# EAGLE board BatteryChargerCombiner (EAGLE 8.5.0)
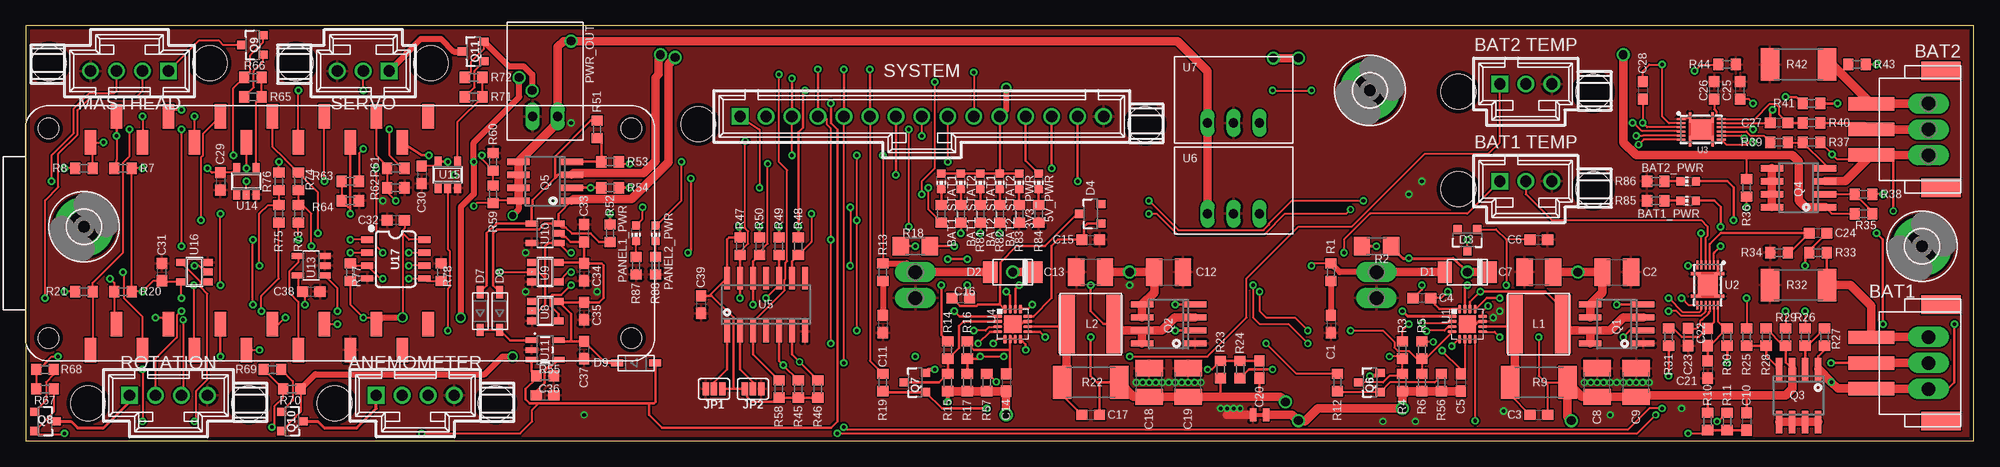
[diagram p2: board, top side]
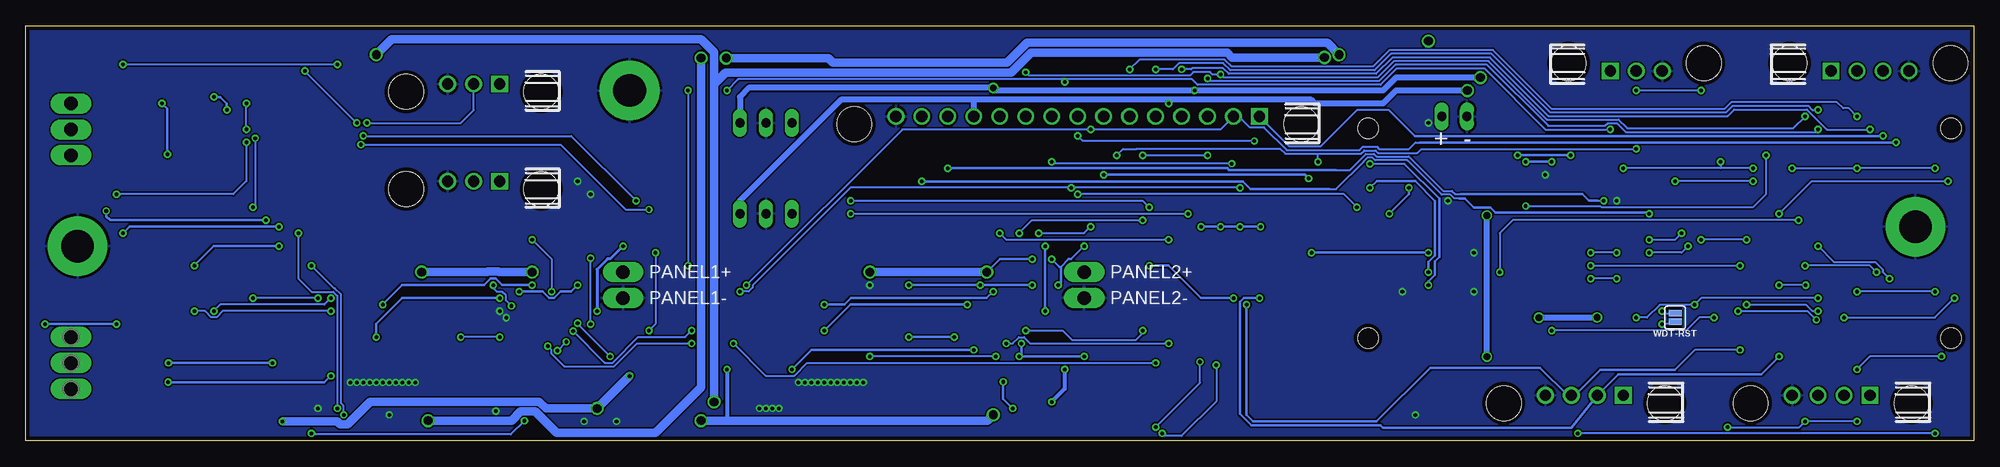
[diagram p3: board, bottom side, seen from below]

Size 190.5 x 40.64 mm. Coordinates in mm from the lower left corner, seen from the top.
Outline: 0,0 190.5,0 190.5,40.64 0,40.64 0,0
Copper layers (1*16): Top 0.0356mm / dielectric 1.5011mm / Bottom 0.0356mm
Design rules "LaenPCBOrder *": minimum track width 6mil, minimum drill 13mil, track to track 6mil, track to pad 6mil, pad to pad 6mil, via to via 6mil, smd to smd 6mil, copper to edge 15mil, drill to drill 6mil, minimum pad ring 7mil, minimum via ring 7mil, stop-mask expansion 4mil, vias tented up to drill 30mil, thermal gap 10mil

## Footprints (pad centres in the part's own frame; a part is rotated, then mirrored left to right if it is on the bottom)
CHIP-LED0603 = smd 0.8 x 0.8: A 0,-0.75; C 0,0.75
70545-POS4 = drill 1.1 square: P$1 3.81,0 | drill 1.1: P$2 1.27,0; P$3 -1.27,0; P$4 -3.81,0 | hole 3.404: -7.874,0.762; 7.874,0.762
JST-XH3-SMD = smd 1.3 x 4.5: BAL 0,-8.75; BAT 2.5,-8.75; RET -2.5,-8.75 | smd 1.8 x 3.9: GND1 -5.7,-1.95; GND2 5.7,-1.95
P1-13Y = drill 1.321 pad 1.905 long: TP 0,0
70545-POS3 = drill 1.1 square: P$1 2.54,0 | drill 1.1: P$2 0,0; P$3 -2.54,0 | hole 3.404: -6.604,0.762; 6.604,0.762
C0603 = smd 1.1 x 1: 1 -0.85,0; 2 0.85,0
C1210 = smd 1.6 x 2.7: 1 -1.4,0; 2 1.4,0
SOD-128 = smd 1.4 x 2.1: A -2.2,0; C 2.2,0
SOT23-3 = smd 0.8 x 0.9: 1 -0.95,-1; 2 0.95,-1; 3 0,1.1
SOD-123 = smd 1.2 x 0.7: A 1.85,0; C -1.85,0
3,2-PAD = drill 3.2 pad 5.842: B3,2 0,0
SMT-JUMPER_3_NO_SILK = smd 0.635 x 1.27: 1 -0.813,0; 2 0,0; 3 0.813,0
DG6050 = smd 1.6 x 5.7: 1 -2.35,0; 2 2.35,0
JST-XH2-THRUHOLE = drill 0.9 long: N -1.23,0; P 1.23,0
SO-08 = smd 0.6 x 2.2: 1 -1.905,-2.6; 2 -0.635,-2.6; 3 0.635,-2.6; 4 1.905,-2.6; 5 1.905,2.6; 6 0.635,2.6; 7 -0.635,2.6; 8 -1.905,2.6
SO08 = smd 0.6 x 2.2: 1 -1.905,-2.6; 2 -0.635,-2.6; 3 0.635,-2.6; 4 1.905,-2.6; 5 1.905,2.6; 6 0.635,2.6; 7 -0.635,2.6; 8 -1.905,2.6
R0603 = smd 1 x 1.1: 1 -0.85,0; 2 0.85,0
R1206 = smd 1.6 x 1.803: 1 -1.422,0; 2 1.422,0
R2512 = smd 1.8 x 3.2: 1 -2.8,0; 2 2.8,0
2PT_GND_TIE = smd 1.27 x 0.635: P$1 0,0.635; P$2 0,-0.635
70545-POS15 = drill 1.1 square: P$1 17.78,0 | drill 1.1: P$2 15.24,0; P$3 12.7,0; P$4 10.16,0; P$5 7.62,0; P$6 5.08,0; P$7 2.54,0; P$8 0,0; P$9 -2.54,0; P$10 -5.08,0; P$11 -7.62,0; P$12 -10.16,0; P$13 -12.7,0; P$14 -15.24,0; P$15 -17.78,0 | hole 3.404: -21.844,0.762; 21.844,0.762
QFN16 = smd 0.85 x 0.3: 1 -1.475,0.75; 2 -1.475,0.25; 3 -1.475,-0.25; 4 -1.475,-0.75; 9 1.475,-0.75; 10 1.475,-0.25; 11 1.475,0.25; 12 1.475,0.75 | smd 0.3 x 0.85: 5 -0.75,-1.475; 6 -0.25,-1.475; 7 0.25,-1.475; 8 0.75,-1.475; 13 0.75,1.475; 14 0.25,1.475; 15 -0.25,1.475; 16 -0.75,1.475 | smd 1.7 x 1.7: TH 0,0
PDSO-N12 = smd 0.2 x 0.85: 1 -1,-1.975; 2 -0.6,-1.975; 3 -0.2,-1.975; 4 0.2,-1.975; 5 0.6,-1.975; 6 1,-1.975; 7 1,1.975; 8 0.6,1.975; 9 0.2,1.975; 10 -0.2,1.975; 11 -0.6,1.975; 12 -1,1.975 | smd 1.95 x 1.95: EP 0,0 | smd 1 x 0.25: EP1 -1.15,1.1; EP2 -1.15,-1.1; EP3 1.15,-1.1; EP4 1.15,1.1
SO-14 = smd 0.6 x 2.2: 1 -3.81,-2.6; 2 -2.54,-2.6; 3 -1.27,-2.6; 4 0,-2.6; 5 1.27,-2.6; 6 2.54,-2.6; 7 3.81,-2.6; 8 3.81,2.6; 9 2.54,2.6; 10 1.27,2.6; 11 0,2.6; 12 -1.27,2.6; 13 -2.54,2.6; 14 -3.81,2.6
WE-78 = drill 0.9 long: 1 -2.54,0; 2 0,0; 3 2.54,0
SOT23-5 = smd 0.69 x 0.99: 1 -0.95,-1.29; 2 0,-1.29; 3 0.95,-1.29; 4 0.95,1.3; 5 -0.95,1.3
DBV-R-PDSO-G5 = smd 0.6 x 1.2: 1 -0.95,-1.306; 2 0,-1.306; 3 0.95,-1.306; 4 0.95,1.306; 5 -0.95,1.306
SOT23-5' = smd 0.55 x 1.2: 1 -0.95,-1.3; 2 0,-1.3; 3 0.95,-1.3; 4 0.95,1.3; 5 -0.95,1.3
MKR1000-SMD = smd 1.143 x 2.413: +5V 39.37,-8.89; A0 36.83,8.89; A1 34.29,11.43; A2 31.75,8.89; A3 29.21,11.43; A4 26.67,8.89; A5 24.13,11.43; A6 21.59,8.89; AREF 39.37,11.43; D0 19.05,11.43; D1 16.51,8.89; D2 13.97,11.43; D3 11.43,8.89; D4 8.89,11.43; D5 6.35,8.89; D6 6.35,-11.43; D7 8.89,-8.89; D8 11.43,-11.43; D9 13.97,-8.89; D10 16.51,-11.43; D11 19.05,-8.89; D12 21.59,-11.43; D13 24.13,-8.89; D14 26.67,-11.43; GND 31.75,-11.43; RST 29.21,-8.89; VCC 34.29,-8.89; VIN 36.83,-11.43 | hole 2: 2.25,10.25; 2.25,-10.25; 59.25,-10.25; 59.25,10.25
SO08' = smd 0.6 x 1.2: 1 -1.905,-2.8; 2 -0.635,-2.8; 3 0.635,-2.8; 4 1.905,-2.8; 5 1.905,2.8; 6 0.635,2.8; 7 -0.635,2.8; 8 -1.905,2.8
SMT-JUMPER_2_NO_SILK = smd 0.635 x 1.27: 1 -0.406,0; 2 0.406,0

## Placement (x,y rotation side)
3V3_PWR  GRN  [CHIP-LED0603]  97.16,25.4 180 top
5V_PWR  BLU  [CHIP-LED0603]  99.06,25.4 180 top
ANEMOMETER  HEADER_POS4_70545  [70545-POS4]  38.1,4.45 180 top
BAT1  2S-BATTERYSMD  [JST-XH3-SMD]  189.23,7.62 270 top
BAT1_BAL  TPPAD1-13Y  [P1-13Y]  186.06,7.62 270 bottom
BAT1_PWR  [CHIP-LED0603]  162.56,23.5 90 top
BAT1_RET  TPPAD1-13Y  [P1-13Y]  186.06,10.16 90 bottom
BAT1_STAT1  RED  [CHIP-LED0603]  89.53,25.4 180 top
BAT1_STAT2  RED  [CHIP-LED0603]  91.44,25.4 180 top
BAT1_TP  TPPAD1-13Y  [P1-13Y]  186.06,5.08 90 bottom
BAT1_TS  HEADER_POS3_70545  [70545-POS3]  146.69,25.4 180 top
BAT2  2S-BATTERYSMD  [JST-XH3-SMD]  189.23,30.48 270 top
BAT2_BAL  TPPAD1-13Y  [P1-13Y]  186.06,30.48 90 top
BAT2_PWR  [CHIP-LED0603]  162.56,25.4 90 top
BAT2_RET  TPPAD1-13Y  [P1-13Y]  186.06,33.02 90 top
BAT2_STAT1  RED  [CHIP-LED0603]  93.34,25.4 180 top
BAT2_STAT2  RED  [CHIP-LED0603]  95.25,25.4 180 top
BAT2_TP  TPPAD1-13Y  [P1-13Y]  186.06,27.94 90 top
BAT2_TS  HEADER_POS3_70545  [70545-POS3]  146.69,34.92 180 top
C1  2u2  [C0603]  127.64,11.43 270 top
C2  10u  [C1210]  155.57,16.51 0 top
C3  100n  [C0603]  147.96,2.54 0 top
C4  100n  [C0603]  136.53,13.97 180 top
C5  1u  [C0603]  140.34,5.71 270 top
C6  1u  [C0603]  147.96,19.68 0 top
C7  10u  [C1210]  147.96,16.51 180 top
C8  10u  [C1210]  153.67,5.71 90 top
C9  4u7  [C1210]  157.48,5.71 90 top
C10  22p  [C0603]  168.28,1.91 270 top
C11  2u2  [C0603]  83.82,11.43 270 top
C12  10u  [C1210]  111.76,16.51 0 top
C13  10u  [C1210]  104.14,16.51 180 top
C14  1u  [C0603]  95.89,5.71 270 top
C15  1u  [C0603]  104.14,19.68 0 top
C16  100n  [C0603]  91.44,13.97 0 top
C17  100n  [C0603]  104.14,2.54 0 top
C18  10u  [C1210]  109.86,5.71 90 top
C19  4u7  [C1210]  113.67,5.71 90 top
C20  22p  [C0603]  120.65,6.99 90 top
C21  100n  [C0603]  164.47,6.99 270 top
C22  1u  [C0603]  164.47,10.16 90 top
C23  2u2  [C0603]  162.56,10.16 270 top
C24  100n  [C0603]  175.26,20.32 180 top
C25  2u2  [C0603]  167.64,34.29 90 top
C26  100n  [C0603]  165.1,34.29 90 top
C27  1u  [C0603]  171.45,31.11 180 top
C28  100n  [C0603]  158.12,34.29 270 top
C29  100n  [C0603]  19.05,25.4 270 top
C30  100n  [C0603]  38.73,26.04 270 top
C31  100n  [C0603]  13.34,16.51 90 top
C32  100n  [C0603]  36.2,21.59 180 top
C33  100n  [C0603]  54.61,20.32 90 top
C34  100n  [C0603]  54.61,16.51 270 top
C35  100n  [C0603]  54.61,12.7 270 top
C36  470p  [C0603]  50.8,4.45 0 top
C37  2u2  [C0603]  54.61,8.89 270 top
C38  100n  [C0603]  27.94,14.61 0 top
C39  100n  [C0603]  66.04,13.34 270 top
D1  SCHOTTKY-SOD128  [SOD-128]  140.97,16.51 0 top
D2  SCHOTTKY-SOD128  [SOD-128]  96.52,16.51 0 top
D3  700mA/40V/533mV  [SOT23-3]  140.97,19.68 180 top
D4  700mA/40V/533mV  [SOT23-3]  104.14,22.23 90 top
D7  [SOD-123]  44.45,12.7 90 top
D8  [SOD-123]  46.35,12.7 90 top
D9  [SOD-123]  59.69,7.62 0 top
H1  MOUNT-PAD-ROUND3.2  [3,2-PAD]  131.44,34.29 0 top
H2  MOUNT-PAD-ROUND3.2  [3,2-PAD]  185.42,19.05 0 top
H3  MOUNT-PAD-ROUND3.2  [3,2-PAD]  5.71,20.95 0 top
JP1  JUMPER-SMT_3_NO_SILK  [SMT-JUMPER_3_NO_SILK]  67.31,5.08 180 top
JP2  JUMPER-SMT_3_NO_SILK  [SMT-JUMPER_3_NO_SILK]  71.12,5.08 180 top
L1  10u  [DG6050]  147.96,11.43 180 top
L2  10u  [DG6050]  104.14,11.43 0 top
MASTHEAD  HEADER_POS4_70545  [70545-POS4]  10.16,36.2 0 top
PANEL1_NEG  TPPAD1-13Y  [P1-13Y]  132.08,13.97 90 top
PANEL1_POS  TPPAD1-13Y  [P1-13Y]  132.08,16.51 90 top
PANEL1_PWR  [CHIP-LED0603]  59.69,20.32 180 top
PANEL2_NEG  TPPAD1-13Y  [P1-13Y]  87,13.97 90 top
PANEL2_POS  TPPAD1-13Y  [P1-13Y]  87,16.51 90 top
PANEL2_PWR  [CHIP-LED0603]  61.59,20.32 180 top
PWR_OUT  PWR  [JST-XH2-THRUHOLE]  50.8,31.75 0 top
Q1  DMN6040SSD-13  [SO-08]  155.57,11.43 90 top
Q2  DMN6040SSD-13  [SO-08]  111.76,11.43 90 top
Q3  DMN6040SSD-13  [SO-08]  173.35,4.45 180 top
Q4  DMN6040SSD-13  [SO-08]  173.35,24.77 90 top
Q5  DMP4047SSD-13  [SO08]  50.8,25.4 90 top
Q6  220mA/50V/3.5Ω  [SOT23-3]  131.44,5.71 90 top
Q7  220mA/50V/3.5Ω  [SOT23-3]  87,5.71 90 top
Q8  4.3A/20V/54mΩ  [SOT23-3]  1.91,1.91 270 top
Q9  4.3A/20V/54mΩ  [SOT23-3]  22.23,38.73 90 top
Q10  4.3A/20V/54mΩ  [SOT23-3]  26.04,1.91 270 top
Q11  4.3A/20V/54mΩ  [SOT23-3]  43.81,38.1 90 top
R1  2R  [R0603]  127.64,16.51 90 top
R2  10R  [R1206]  132.08,19.05 180 top
R3  232K  [R0603]  134.62,8.89 90 top
R4  15K  [R0603]  134.62,5.71 90 top
R5  [R0603]  136.53,8.89 90 top
R6  [R0603]  136.53,5.71 90 top
R7  10K  [R0603]  9.53,26.67 0 top
R8  10K  [R0603]  5.71,26.67 180 top
R9  40m  [R2512]  147.96,5.71 0 top
R10  300K  [R0603]  164.47,1.91 90 top
R11  100K  [R0603]  166.37,1.91 270 top
R12  100R  [R0603]  128.27,5.71 270 top
R13  2R  [R0603]  83.82,16.51 90 top
R14  232K  [R0603]  90.17,8.89 90 top
R15  15K  [R0603]  90.17,5.71 90 top
R16  [R0603]  92.08,8.89 90 top
R17  [R0603]  92.08,5.71 90 top
R18  10R  [R1206]  87,19.05 0 top
R19  100R  [R0603]  83.82,5.71 270 top
R20  10K  [R0603]  9.53,14.61 0 top
R21  10K  [R0603]  5.71,14.61 180 top
R22  40m  [R2512]  104.14,5.71 0 top
R23  300K  [R0603]  116.84,6.99 270 top
R24  100K  [R0603]  118.75,6.99 90 top
R25  5K1  [R0603]  168.28,10.16 270 top
R26  5K1  [R0603]  173.99,10.16 270 top
R27  10M  [R0603]  175.9,10.16 270 top
R28  10M  [R0603]  170.18,10.16 90 top
R29  10R  [R0603]  172.09,10.16 270 top
R30  100R  [R0603]  166.37,10.16 90 top
R31  5R  [R0603]  160.66,10.16 90 top
R32  2m  [R2512]  173.35,15.24 180 top
R33  100R  [R0603]  175.26,18.41 0 top
R34  100R  [R0603]  171.45,18.41 180 top
R35  10M  [R0603]  179.71,22.23 180 top
R36  10R  [R0603]  168.28,24.77 90 top
R37  10M  [R0603]  174.62,29.21 0 top
R38  5K1  [R0603]  179.71,24.13 180 top
R39  5K1  [R0603]  171.45,29.21 0 top
R40  100R  [R0603]  174.62,31.11 180 top
R41  5R  [R0603]  174.62,33.02 180 top
R42  2m  [R2512]  173.35,36.83 180 top
R43  100R  [R0603]  179.07,36.83 180 top
R44  100R  [R0603]  166.37,36.83 0 top
R45  4K7  [R0603]  75.56,5.08 90 top
R46  4K7  [R0603]  77.47,5.08 90 top
R47  4K7  [R0603]  69.85,19.05 270 top
R48  4K7  [R0603]  75.56,19.05 270 top
R49  4K7  [R0603]  73.66,19.05 270 top
R50  4K7  [R0603]  71.75,19.05 270 top
R51  10M  [R0603]  55.88,30.48 270 top
R52  10M  [R0603]  57.15,20.32 90 top
R53  100R  [R0603]  57.15,27.3 0 top
R54  100R  [R0603]  57.15,24.77 0 top
R55  10M  [R0603]  50.8,6.35 0 top
R56  10K  [R0603]  138.43,5.71 90 top
R57  10K  [R0603]  93.98,5.71 90 top
R58  4K7  [R0603]  73.66,5.08 90 top
R59  15K  [R0603]  45.72,24.13 270 top
R60  10K  [R0603]  45.72,27.3 270 top
R61  75K  [R0603]  36.2,26.67 0 top
R62  12K  [R0603]  36.2,24.77 180 top
R63  75K  [R0603]  31.75,25.4 0 top
R64  12K  [R0603]  31.75,23.5 180 top
R65  100R  [R0603]  22.23,33.66 0 top
R66  10M  [R0603]  22.23,35.56 0 top
R67  10M  [R0603]  1.91,5.08 180 top
R68  100R  [R0603]  1.91,6.99 180 top
R69  100R  [R0603]  24.13,6.99 180 top
R70  10M  [R0603]  26.04,5.08 180 top
R71  100R  [R0603]  43.81,33.66 0 top
R72  10M  [R0603]  43.81,35.56 0 top
R73  10K  [R0603]  26.67,22.23 270 top
R74  15K  [R0603]  26.67,25.4 270 top
R75  10K  [R0603]  24.77,22.23 270 top
R76  15K  [R0603]  24.77,25.4 270 top
R77  10K  [R0603]  31.75,16.51 270 top
R78  10K  [R0603]  40.64,16.51 270 top
R79  1K  [R0603]  89.53,22.23 270 top
R80  1K  [R0603]  91.44,22.23 270 top
R81  1K  [R0603]  93.34,22.23 270 top
R82  1K  [R0603]  95.25,22.23 270 top
R83  1K  [R0603]  97.16,22.23 90 top
R84  1K  [R0603]  99.06,22.23 90 top
R85  10K  [R0603]  159.38,23.5 0 top
R86  10K  [R0603]  159.38,25.4 0 top
R87  10K  [R0603]  59.69,17.14 90 top
R88  10K  [R0603]  61.59,17.14 90 top
ROTATION  HEADER_POS4_70545  [70545-POS4]  13.97,4.45 180 top
SUPPLY1  2PT_GND_TIE  [2PT_GND_TIE]  120.65,2.54 90 top
SYSTEM  HEADER_POS15_70545  [70545-POS15]  87.63,31.75 180 top
TAIL  HEADER_POS3_70545  [70545-POS3]  33.02,36.2 0 top
U1  BQ24650  [QFN16]  140.97,11.43 0 top
U2  BQ28Z610  [PDSO-N12]  164.47,15.24 180 top
U3  BQ28Z610  [PDSO-N12]  163.83,30.48 270 top
U4  BQ24650  [QFN16]  96.52,11.43 0 top
U5  TCA9543A  [SO-14]  72.39,13.34 0 top
U6  WE-78  [WE-78]  118.11,22.23 0 top
U7  WE-78  [WE-78]  118.11,31.11 0 top
U8  74AHC1G07DBV  [SOT23-5]  50.8,12.7 270 top
U9  74AUC1G06DBV  [SOT23-5]  50.8,16.51 270 top
U10  TS7211  [DBV-R-PDSO-G5]  50.8,20.32 90 top
U11  MIC5219 3.3V  [SOT23-5']  50.8,8.89 270 top
U12  MKR1000-SMD  [MKR1000-SMD]  0,20.32 0 top
U13  STWD100  [DBV-R-PDSO-G5]  27.94,17.14 90 top
U14  74AUC1G06DBV  [SOT23-5]  21.59,25.4 0 top
U15  74AUC1G06DBV  [SOT23-5]  41.27,26.04 0 top
U16  74AUC1G06DBV  [SOT23-5]  16.51,16.51 90 top
U17  LMV358  [SO08']  36.2,17.78 270 top
WDT-RST  JUMPER-SMT_2_NO_SILK  [SMT-JUMPER_2_NO_SILK]  29.21,12.06 90 bottom

## Tracks (layer width: path | path; a pad name or v marks a point on that pad's centre or on a via)
!BAT1_CE!  (via drill 0.35)
  Top 0.203: R12.1 124.25,6.57 v121.28,9.53 | v80.01,7.62 SYSTEM.P$5 | v15.24,32.38 13.97,32.38 U12.D2
  Top 0.254: v80.01,36.35 SYSTEM.P$5
  Bottom 0.203: v80.01,7.62 114.08,7.62 115.32,6.38 118.14,6.38 v121.28,9.53 | v15.24,32.38 15.78,32.38 16.19,32.79 23.6,32.79 24.23,32.15 41.44,32.15 47.16,37.87 57,37.87 58.61,36.27 72.72,36.27 73.41,36.97 77.72,36.97 78.33,36.35 v80.01,36.35
!BAT2_CE!  (via drill 0.35)
  Top 0.203: SYSTEM.P$6 82.55,7.83 R19.1 | v11.43,31.75 U12.D3
  Top 0.254: v82.55,36.35 82.55,32.38 SYSTEM.P$6
  Bottom 0.203: v11.43,31.75 12.22,32.54 12.79,32.54 13.39,33.14 23.74,33.14 24.38,32.51 41.29,32.51 47.01,38.23 57.15,38.23 58.75,36.63 72.57,36.63 73.26,37.32 81.58,37.32 v82.55,36.35
!I2C_RST!  (via drill 0.35)
  Top 0.203: U5.3 71.12,11.64 74.21,14.73 74.21,15.79 74.3,15.88 74.3,17.43 74.46,17.59 74.46,26.49 73.66,27.3 v73.66,35.85 | v92.71,36.07 SYSTEM.P$10 | v16.51,31.75 U12.D1
  Top 0.254: U5.3 71.12,8.47 R58.2
  Bottom 0.203: v92.71,36.07 92.38,35.74 76.65,35.74 76.31,36.08 74.68,36.08 74.45,35.85 v73.66,35.85 73.37,35.56 58.31,35.56 56.71,37.16 47.45,37.16 41.73,31.44 34.75,31.44 33.89,30.58 17.68,30.58 v16.51,31.75
+3V3  (via drill 0.35, 0.65, 0.85)
  Top 0.203: U13.5 26.63,15.06 C38.1 27.3,14.39 v27.3,13.34 | v33.02,12.06 | C30.1 39.88,26.89 U15.5 40.35,27.3 | R8.2 v3.81,26.67 | v11.43,26.67 R7.2 R20.2 v11.43,14.61 12.48,15.66 C31.1 13.44,15.56 U16.5 15.21,14 v15.24,13.97 | R21.2 v3.81,14.61 | R77.2 31.75,13.34 v33.02,12.06 | C32.1 37.05,20.76 36.86,20.57 36.86,20.32 | 36.84,12.06 v36.86,12.08 36.86,20.32 | v33.02,12.06 33.65,12.06 U12.VCC | U17.8 37.49,19.68 36.86,20.32 | U14.5 20.19,26.25 C29.1 18.2,26.25 v17.78,26.67
  Top 0.254: 66.83,14.19 U5.14 68.58,19.68 68.8,19.9 R47.1 69.85,20.95 v69.75,20.95 | 66.83,14.19 C39.1 | 69.22,5.08 JP2.3 70.52,4.86 70.52,4.33 71.04,3.81 73.03,3.81 73.44,4.23 R58.1 R45.1 R46.1 | 69.22,5.08 JP1.1 | 66.83,14.19 67.09,14.19 69.22,12.06 69.22,5.08 | R48.1 v75.56,20.95 75.56,30.19 76.03,30.66 76.03,34.12 v76.2,34.29 | v73.66,20.95 R49.1 | R50.1 v71.75,20.95 | U15.5 41.24,27.34 v41.27,27.3 | BAT2_STAT2.A SYSTEM.P$11 | BAT1_STAT1.A BAT1_STAT2.A BAT2_STAT1.A BAT2_STAT2.A | BAT2_STAT2.A 3V3_PWR.A
  Top 0.61: v95.89,34.54 95.89,32.38 SYSTEM.P$11 | v42.55,12.06 42.55,22.86 43.81,24.13 v43.81,27.3 43.81,29.2 48.26,33.65 v48.26,35.56 | U12.VCC 34.92,12.06 36.84,12.06
  Bottom 0.203: v33.02,12.06 31.97,12.06 30.73,13.31 27.33,13.31 v27.3,13.34 26.67,13.97 v15.24,13.97 | v3.81,26.67 v11.43,26.67 v17.78,26.67 | v3.81,14.61 v11.43,14.61
  Bottom 0.254: v75.56,20.95 v73.66,20.95 v71.75,20.95 v69.75,20.95 | v41.27,27.3 v43.81,27.3
  Bottom 0.61: v42.55,12.06 36.84,12.06 | 36.83,12.06 36.84,12.06 | 36.84,12.06 v36.86,12.08 | v48.26,35.56 56.52,35.56 57.78,34.29 v76.2,34.29 95.63,34.29 v95.89,34.54 119.76,34.54 120.65,33.66 U7.3
+5V  (via drill 0.35, 0.85)
  Top 0.203: R67.1 2.75,2.86 2.3,2.41 2.3,2.35 Q8.2 1.23,0.64 3.81,0.64 v3.81,0.73 | v38.73,0.73 48.36,0.73 49.53,1.91 49.53,3.03 50.16,3.67 | R72.1 43.55,36.15 43.55,37.1 44.81,38.36 Q11.2
  Top 0.254: U11.3 49.5,6.8 R55.1 49.95,6.13 48.9,5.08 48.9,4.05 49.28,3.67 50.16,3.67 60.96,3.67 | D9.A 61.59,7.57 61.59,3.81 61.45,3.67 60.96,3.67 | 60.96,3.67 60.96,2.54 62.23,1.27 78.74,1.27 79.38,1.91 79.38,30.48 78.74,31.11 v78.74,33.02 | 5V_PWR.A 97.79,27.42 SYSTEM.P$12
  Top 0.61: Q11.2 47.21,36.66 48.71,36.66 49.53,35.84 v49.53,34.29
  Bottom 0.203: v3.81,0.73 38.64,0.73 38.73,0.64 v38.73,0.73 | v78.74,33.02 78.74,33.38
  Bottom 0.61: v49.53,34.29 56.52,34.29 57.78,33.02 64.44,33.02 64.8,33.38 78.74,33.38 97.79,33.38 | 97.79,33.38 110.77,33.38 120.65,23.5 U6.3 | SYSTEM.P$12 97.79,33.38
AGND  (via drill 0.35, 0.85)
  Top 0.254: R11.1 165.52,1.91 v165.38,1.91 | R24.1 119.59,6.99 v121.92,6.99
  Top 0.406: Q6.2 132.13,6.35 v131.44,6.35 | Q7.2 88.31,6.99 v88.9,6.99 | v90.17,3.81 R15.1
  Top 0.813: C5.2 R56.1 R6.1 R4.1 v134.62,3.17 126.36,3.17 125.09,1.91 124.54,1.91 v124.46,1.98 124.38,1.98 | R15.1 R17.1 R57.1 C14.2 v95.89,2.54 | SUPPLY1.P$2 123.83,2.54 124.38,1.98 | 124.46,1.91 124.38,1.98
  Bottom 0.406: v121.92,6.99 121.92,1.98 | v88.9,6.99 88.9,5.08 v90.17,3.81
  Bottom 0.813: v165.38,1.91 160.04,1.91 159.76,1.63 159.01,1.63 156.79,3.84 140.27,3.84 139.6,3.17 v134.62,3.17 v131.44,6.35 | v124.46,1.98 121.92,1.98 96.44,1.98 v95.89,2.54
BAT1  (via drill 0.35)
  Top 0.254: R27.2 175.9,8.89 175.26,8.26 Q3.1 | R31.1 v160.66,6.35 | BAT1_PWR.A 165.1,23.5 165.74,22.86 v165.74,20.95 | v180.97,20.32 181.61,19.68 v181.61,11.43 | BAT1_TP.TP 187.96,5.08 188.59,5.71 v188.59,11.43
  Top 0.813: Q3.1 v176.56,5.75 177.19,5.12 BAT1.BAT 180.52,5.08 BAT1_TP.TP
  Bottom 0.254: v160.66,6.35 161.29,5.71 176.53,5.71 v176.56,5.75 | v165.74,20.95 180.34,20.95 v180.97,20.32 | v181.61,11.43 v188.59,11.43
BAT1_BAL  (via drill 0.35)
  Top 0.254: v166.37,7.62 R30.1 | BAT1.BAL v176.53,7.62
  Top 0.813: BAT1_BAL.TP BAT1.BAL
  Bottom 0.254: v176.53,7.62 v166.37,7.62
BAT1_RET
  Top 0.254: R33.2 176.11,15.29 R32.1
  Top 0.813: R32.1 178.44,15.24 180.48,13.2 BAT1.RET 180.52,10.16 BAT1_RET.TP
BAT1_STAT1  (via drill 0.35)
  Top 0.203: U1.3 139.4,11.08 139.03,11.08 138.74,10.79 137.01,10.79 v136.96,10.74 | SYSTEM.P$1 71.75,30.48 v71.75,24.77 | v125.37,10.79 124.1,12.06 121.28,12.06 120.65,12.7 v120.65,14.61 | v8.89,29.84 8.89,27.52 R7.1 | R79.2 88.27,22.64 v88.27,24.77
  Top 0.254: v8.89,29.84 U12.D4
  Bottom 0.203: v136.96,10.74 133.86,7.65 133.1,7.65 130.59,10.16 126.01,10.16 v125.37,10.79 | v71.75,24.77 v88.27,24.77 109.86,24.77 119.41,15.21 119.41,14.99 119.79,14.61 v120.65,14.61 | SYSTEM.P$1 66.9,28.8 63.91,28.8 60.33,32.38 57.2,32.38 54.66,29.84
  Bottom 0.254: v8.89,29.84 54.66,29.84
BAT1_STAT2  (via drill 0.35)
  Top 0.203: U1.5 140.13,9.96 v139.45,9.27 | v125.37,9.53 123.47,11.43 120.65,11.43 120.02,12.06 v120.02,15.24 | U12.D5 | U12.D5 v7.62,29.21 | R8.1 6.57,29 U12.D5 | 91.44,20.95 R80.2 v91.44,20.32 | v86.36,20.95 v86.36,30.48
  Bottom 0.203: v139.45,9.27 139.1,8.93 139.1,8.57 137.82,7.29 132.95,7.29 130.72,9.53 v125.37,9.53 | v120.02,15.24 104.78,30.48 v86.36,30.48 73.66,30.48 SYSTEM.P$2 71.86,31.75 70.78,30.67 69.41,30.67 67.18,28.45 60.08,28.45 59.75,28.78 58.36,28.78 58.16,28.57 55.24,28.57 54.61,29.21 54.17,29.21 | v91.44,20.32 87,20.32 v86.36,20.95
  Bottom 0.254: 54.17,29.21 v7.62,29.21
BAT1_TS1  (via drill 0.35)
  Top 0.203: R5.1 R6.2 | U1.4 136.85,8.04 R5.1 | R5.1 136.03,8.04 135.28,8.79 134.16,8.79 133.82,9.13 133.82,9.69 132.72,10.79 v129.54,10.79 | BAT1_TS.P$1 140.97,22.23 131.44,22.23 128.91,19.68 v128.91,18.41
  Bottom 0.203: v128.91,18.41 128.91,11.43 v129.54,10.79
BAT1_TS2
  Top 0.203: U2.4 164.26,19.9 164.44,20.07 164.44,20.98 163.83,21.59 149.22,21.59 146.69,24.13 BAT1_TS.P$2
BAT2  (via drill 0.35)
  Top 0.203: R37.2 v176.64,28.05 177.11,27.57 180.07,27.57
  Top 0.254: R41.1 v177.16,33.02 | BAT2_PWR.A 166.37,25.4 167,24.77 v167,21.59 | v182.61,22.49 182.61,27.61 182.25,27.98
  Top 0.813: BAT2_TP.TP 186.01,27.98 182.25,27.98 BAT2.BAT 180.07,27.57 177.9,25.4 Q4.3
  Bottom 0.254: v177.16,33.02 176.64,32.49 v176.64,28.05 | v167,21.59 182.25,21.59 182.61,21.96 v182.61,22.49
BAT2_BAL
  Top 0.254: BAT2.BAL 179.84,31.11 R40.1
  Top 0.813: BAT2_BAL.TP BAT2.BAL
BAT2_RET
  Top 0.254: R43.2 177.63,36.24 177.22,36.24
  Top 0.813: BAT2_RET.TP 186.01,32.98 BAT2.RET 177.22,36.24 176.63,36.83 R42.1
BAT2_STAT1  (via drill 0.35)
  Top 0.203: U4.3 94.95,11.08 94.15,11.08 93.86,10.79 v92.71,10.79 | v81.28,10.79 v81.28,21.59 v81.28,27.94 | v74.93,27.94 SYSTEM.P$3 | U12.D7 8.68,12.28 R20.1 8.68,15.46 v8.26,15.88 | v15.24,30.48 v15.24,19.05 | R81.2 v93.34,20.32
  Top 0.254: U12.D7 8.89,12.06 | v74.93,35.48 SYSTEM.P$3
  Bottom 0.203: v92.71,10.79 89.11,10.79 88.2,9.88 81.92,9.88 81.28,10.52 v81.28,10.79 | v81.28,27.94 v74.93,27.94 | v15.24,30.48 15.24,30.23 34.04,30.23 34.9,31.09 35.81,31.09 36.06,30.84 41.63,30.84 47.6,36.81 56.56,36.81 58.16,35.2 74.66,35.2 v74.93,35.48 | v15.24,19.05 13.69,17.5 9.66,17.5 8.92,16.76 8.92,16.54 v8.26,15.88 | v93.34,20.32 92.08,21.59 v81.28,21.59
BAT2_STAT2  (via drill 0.35)
  Top 0.203: U4.5 95.05,9.96 v94.61,9.53 | v78.74,9.53 v78.74,19.68 78.74,30.58 78.36,30.96 78.36,31.5 SYSTEM.P$4 | U12.D6 6.57,9.73 R21.1 6.57,15.46 9.53,18.41 9.53,27.23 10.16,27.86 v10.16,30.48 | R82.2 v95.25,20.32
  Top 0.254: v77.47,36.36 SYSTEM.P$4
  Bottom 0.203: v94.61,9.53 93.99,9.53 93.38,10.13 92.88,10.13 92.27,9.53 v78.74,9.53 | v10.16,30.48 14.38,30.48 16.34,32.43 23.45,32.43 24.08,31.8 41.59,31.8 47.31,37.52 56.86,37.52 58.46,35.92 72.86,35.92 73.41,36.46 76.44,36.46 76.54,36.36 v77.47,36.36 | v95.25,20.32 94.61,19.68 v78.74,19.68
BAT2_TS1  (via drill 0.35)
  Top 0.203: v107.95,8.26 115.57,8.26 119.38,12.06 119.38,15.88 124.46,20.95 129.67,20.95 136.81,28.09 143.03,28.09 144.15,29.21 BAT2_TS.P$1 | v93.34,8.26 v95.64,8.26
  Top 0.254: R17.2 R16.1 93.13,8.04 v93.34,8.26 | U4.4 94.28,10.68 v93.13,9.53
  Bottom 0.203: v95.64,8.26 v107.95,8.26
  Bottom 0.254: v93.13,9.53 93.13,8.47 v93.34,8.26 v87,8.26
BAT2_TS2  (via drill 0.35)
  Top 0.203: U3.4 161.81,30.32 158.05,30.32 157.26,31.11 v157.12,31.11
  Bottom 0.203: v157.12,31.11 147.96,31.11 146.69,32.38 BAT2_TS.P$2
BAT_SELECT  (via drill 0.35)
  Top 0.203: v46.35,16.51 U9.2 | U12.D0 17.34,30.03 17.34,27.89 17.14,27.7 v17.14,21.59
  Top 0.254: U9.2 50.16,16.51 50.8,15.88 | 50.8,15.88 50.8,13.34 50.16,12.7 U8.2 | 50.8,15.88 50.8,19.05 51.12,19.37 U10.1 53.06,18.41 v53.34,18.41 | v85.09,26.04 SYSTEM.P$7 | v65.05,25.68 65.05,18.69 v64.77,18.41
  Bottom 0.203: v46.35,16.51 46.35,20.32 45.09,21.59 v17.14,21.59
  Bottom 0.254: v85.09,26.04 65.41,26.04 v65.05,25.68 | v64.77,18.41 v53.34,18.41
COS  (via drill 0.35)
  Top 0.203: v34.29,26.67 34.29,19.05 v34.92,18.41 | v37.47,18.41 U17.7 | U12.A6 v21.59,26.67 | R76.1 v24.77,27.3
  Bottom 0.203: v21.59,26.67 24.77,26.67 | 24.77,26.67 v34.29,26.67 | v34.92,18.41 v37.47,18.41 | v24.77,27.3 24.77,26.67
COS_IN  (via drill 0.35)
  Top 0.203: v23.05,12.7 23.05,14.16 24.77,15.88 R75.2 | v15.4,11.84 15.4,4.61 ROTATION.P$3
  Bottom 0.203: v23.05,12.7 16.29,12.7 15.43,11.84 v15.4,11.84
DIM  (via drill 0.35)
  Top 0.203: U12.D10 16.51,15.17 v16.44,15.24 | v19.05,15.24 v19.05,22.23 | v2.54,25.4 2.54,27.94 4.72,30.12 4.72,32.53 6.2,34.01 8.61,34.01 8.89,34.29 MASTHEAD.P$3
  Bottom 0.203: v16.44,15.24 v19.05,15.24 | v19.05,22.23 15.88,25.4 v2.54,25.4
GND  (via drill 0.35)
  Top 0.203: U1.11 142.35,11.58 141.98,11.58 141.83,11.43 U1.TH
  Top 0.254: U2.1 165.47,16.49 U2.EP2 | U2.EP3 164.44,15.21 | 164.44,15.21 165.51,14.14 U2.EP1 | U2.EP4 164.39,15.21 164.44,15.21 | U3.EP 164.93,31.58 U3.EP1 | U3.EP 162.73,29.38 U3.EP3 | U3.1 162,31.63 U3.EP2 | U3.EP 164.93,29.38 U3.EP4 | U4.11 97.92,11.61 97.52,11.61 97.34,11.43 U4.TH | 164.44,15.21 U2.EP
  Top 0.813: SUPPLY1.P$1 117.47,2.54
  other vias: 152.4,5.71 153.03,5.71 153.67,5.71 154.31,5.71 154.94,5.71 155.57,5.71 156.21,5.71 156.84,5.71 157.48,5.71 158.12,5.71 158.75,5.71 108.58,5.71 109.22,5.71 109.86,5.71 110.49,5.71 111.12,5.71 111.76,5.71 112.39,5.71 113.03,5.71 113.67,5.71 114.3,5.71 114.94,5.71 118.75,3.17 118.11,3.17 117.47,3.17 116.84,3.17 143.51,12.06 144.15,12.7 55.88,14.61 48.9,18.41 48.9,14.61 132.72,1.91 135.89,1.91 136.53,25.4 135.25,24.13 161.93,3.17 154.94,2.54 144.53,2.92 107.95,15.24 53.34,31.11 51.44,23.5 54.61,2.54 34.92,23.5 41.91,26.04
  pour Top: 0,0 191.13,0 191.13,41.91 0,41.91
  pour Bottom: 0,0 0,42.55 191.13,42.55 191.13,0
LOGIC_PWR
  Top 0.254: U9.5 54.51,17.46 C34.1 | C34.1 C33.1 53.3,19.47 52.82,19.95 52.48,19.95 U10.2 | D9.C 56.73,7.62 C37.1 53.34,9.74 | 53.34,9.74 52.2,9.74 U11.5 | 53.34,9.74 53.34,12.41 U8.5 52.2,13.55 C35.1 56.09,13.55 56.52,13.97 56.52,17.14 56.3,17.36 C34.1
MASTHEAD_PWR  (via drill 0.35)
  Top 0.203: U14.2 v21.59,25.4 | v29.21,25.4 U12.A3
  Bottom 0.203: v21.59,25.4 v29.21,25.4
MPPSET1  (via drill 0.35)
  Top 0.203: Q6.3 132.72,5.71 133.35,6.35 134.41,6.35 R4.2 R3.1 134.41,8.26 v133.35,8.26 | v136.53,11.52 138.97,11.52 139.03,11.58 139.4,11.58 U1.2
  Bottom 0.203: v133.35,8.26 136.53,11.43 v136.53,11.52
MPPSET2
  Top 0.254: Q7.3 89.32,5.71 R15.2 R14.1 91.25,9.12 91.25,11.24 91.69,11.68 U4.2
N$1
  Top 0.61: R1.1 C1.1
N$2
  Top 0.305: Q8.3 4.45,1.91 5.08,1.27 7.62,1.27 10.16,3.81 ROTATION.P$1
N$3  (via drill 0.35)
  Top 0.305: R2.2 v132.08,19.05 | U1.1 135.14,12.18 v134.62,12.7
  Bottom 0.305: v132.08,19.05 133.32,17.8 133.61,17.8 134.62,16.79 v134.62,12.7
N$4  (via drill 0.35, 0.85)
  Top 0.203: R3.2 134.62,10.79 v135.25,11.43
  Top 0.305: v140.97,16.51 140.95,16.51 139.6,17.86 v135.25,17.86 134.69,17.86 R2.1
  Top 0.813: Q1.6 Q1.5 154.18,14.54 C2.1 v151.76,16.51 C7.1 | D1.C v140.97,16.51
  Bottom 0.203: v135.25,11.43 v135.25,17.86
  Bottom 0.813: v140.97,16.51 144.19,16.51 144.23,16.56 145.33,16.56 145.37,16.51 v151.76,16.51
N$5  (via drill 0.35)
  Top 0.254: Q1.4 v155.57,13.34 | U1.15 140.72,14.99 v140.97,15.24
  Bottom 0.254: v155.57,13.34 153.67,15.24 145.67,15.24 145.04,15.87 144.52,15.87 143.89,15.24 v140.97,15.24
N$6  (via drill 0.35)
  Top 0.254: U1.14 141.22,13.59 v142.24,14.61 148.59,14.61 150.31,12.89 L1.1 | C4.2 136.53,14.82 v136.53,15.24
  Top 0.813: Q1.7 150.94,10.79 L1.1 | Q1.8 Q1.7 | Q1.3 156.21,12.06 154.94,10.79 Q1.7
  Bottom 0.254: v136.53,15.24 137.16,14.61 138.17,14.61 138.8,13.97 139.33,13.97 139.96,14.61 v142.24,14.61
N$7  (via drill 0.35)
  Top 0.254: v144.15,13.97 142.88,13.97 141.81,12.9 U1.13 | v156.21,10.16 156.84,10.79 Q1.2
  Bottom 0.254: v144.15,13.97 153.67,13.97 156.21,11.43 v156.21,10.16
N$8
  Top 0.203: R56.2 138.43,6.35 137.79,5.71 133.4,5.71 Q6.1 128.37,4.76 R12.2
N$9
  Top 0.203: C3.1 145.16,4.49 R9.1
  Top 0.254: U1.10 145.35,11.18 L1.2
  Top 0.813: L1.2 145.6,6.17 R9.1
N$10  (via drill 0.35)
  Top 0.203: D3.3 v140.97,19.68 | v139.06,14.61 138.43,13.97 C4.1
  Top 0.254: U1.16 138.22,12.9 137.79,13.34 137.79,13.55 C4.1
  Bottom 0.203: v140.97,19.68 139.06,17.78 v139.06,14.61
N$11  (via drill 0.35)
  Top 0.203: v143,13.21 142.44,12.65 U1.12 | 144.78,19.68 v144.78,15.24 | D3.1 143.78,20.68 144.78,19.68 | C6.1 144.78,19.68
  Bottom 0.203: v143,13.21 143.54,13.74 143.54,14.22 143.89,14.58 144.38,14.58 144.78,14.98 v144.78,15.24
N$12  (via drill 0.35)
  Top 0.203: U1.8 v141.72,1.97 | v162.56,0.73 164.14,0.73 R10.1
  Top 0.254: R10.1 R11.2 C10.2
  Bottom 0.203: v141.72,1.97 143.05,0.64 162.56,0.64 v162.56,0.73
N$13  (via drill 0.35)
  Top 0.254: U4.15 96.27,14.22 v95.89,14.61 | v112.39,13.34 Q2.4
  Bottom 0.254: v112.39,13.34 110.43,13.34 109.8,13.97 96.52,13.97 v95.89,14.61
N$14
  Top 0.254: R79.1 BAT1_STAT1.C
N$15
  Top 0.61: R13.1 C11.1
N$16
  Top 0.254: U4.12 98.54,12.18 100.33,13.97 100.33,19.05 100.97,19.68 C15.1 103.5,19.9 103.5,20.95 103.83,21.27 D4.1
N$17
  Top 0.254: 95.25,13.34 93.1,13.34 92.96,13.19 91.37,13.19 C16.1 | U4.16 95.68,12.9 95.25,13.34 | 95.25,13.34 95.25,15.29 95.3,15.34 95.3,17.46 96.89,19.05 99.69,19.05 102.87,22.23 D4.3
N$18  (via drill 0.35)
  Top 0.203: v160.66,13.97 162.04,12.59 163.67,12.59 163.82,12.74 163.82,13.22 U2.8 | v172.09,12.7 R29.1
  Bottom 0.203: v160.66,13.97 161.29,13.34 171.45,13.34 v172.09,12.7
N$19  (via drill 0.35, 0.85)
  Top 0.254: R14.2 89.53,10.38 v89.53,15.24 | v87,19.05 R18.1 | v92.08,17.78 v90.17,17.78
  Top 0.813: C13.1 v107.95,16.51 C12.1 110.36,14.54 Q2.5 Q2.6 | D2.C v96.52,16.51
  Bottom 0.254: 89.26,17.04 88.51,17.78 88.27,17.78 v87,19.05 | v89.53,15.24 89.26,15.52 89.26,17.04 | v96.52,16.51 95.25,17.78 v92.08,17.78 | v90.17,17.78 89.43,17.04 89.26,17.04
  Bottom 0.813: v96.52,16.51 v107.95,16.51
N$20  (via drill 0.35)
  Top 0.254: U4.14 96.77,14.86 v97.16,15.24 | v104.14,15.24 104.14,12.7 105.41,11.43 L2.2 | C16.2 92.08,14.19 v92.08,15.24
  Top 0.813: Q2.7 111.12,10.79 112.39,12.06 Q2.3 | Q2.8 Q2.7 | Q2.7 107.12,10.79 L2.2
  Bottom 0.254: v104.14,15.24 v97.16,15.24 v92.08,15.24
N$21  (via drill 0.35)
  Top 0.254: U4.13 98,12.9 v98.42,13.34 | v112.41,10.79 Q2.2
  Bottom 0.254: v98.42,13.34 109.86,13.34 v112.41,10.79
N$22
  Top 0.254: C17.1 101.34,4.49 R22.1 | U4.10 101.54,11.18 L2.1
  Top 0.813: L2.1 101.79,6.17 R22.1
N$23  (via drill 0.35)
  Top 0.254: U4.1 91.33,12.18 v90.81,12.7 | v90.81,19.05 R18.2
  Bottom 0.254: v90.81,12.7 v90.81,19.05
N$24  (via drill 0.35)
  Top 0.254: R19.2 83.92,4.76 Q7.1 89.58,3.17 v93.98,3.17 | v94.91,5.78 94.12,6.57 R57.2
  Bottom 0.254: v93.98,3.17 94.91,4.1 v94.91,5.78
N$25
  Top 0.813: Q3.8 Q3.7 Q3.6 Q3.5
N$26
  Top 0.254: Q3.4 170.18,8.31 R28.1 R25.2
N$27  (via drill 0.35)
  Top 0.254: C20.2 R24.2 R23.1 115.99,6.99 v115.57,6.99 | v97.79,8.89 97.79,9.44 U4.8
  Bottom 0.254: v115.57,6.99 113.67,8.89 v97.79,8.89
N$28
  Top 0.254: Q3.2 R26.2 174.19,9.31 R27.1
N$29  (via drill 0.35)
  Top 0.203: U2.7 162.63,13.27 v161.93,13.97 | v168.28,13.97 R25.1
  Bottom 0.203: v161.93,13.97 v168.28,13.97
N$30
  Top 0.813: Q4.5 Q4.6 Q4.7 Q4.8
N$31  (via drill 0.35)
  Top 0.203: U2.9 164.22,13.22 164.22,12.63 163.82,12.23 161.89,12.23 161.42,12.7 v160.66,12.7 | v173.99,12.7 R26.1
  Bottom 0.203: v160.66,12.7 171.23,12.7 171.83,12.09 172.34,12.09 172.94,12.7 v173.99,12.7
N$32
  Top 0.203: U2.12 165.47,11.7 166.26,10.9
  Top 0.254: R30.2 166.26,10.9 164.67,9.31 C22.1 C21.1
N$33
  Top 0.203: U2.11 165.06,11.61 C22.2
  Top 0.254: R31.2 161.12,11.01 161.94,10.18 163.17,10.18 163.19,10.16 163.62,10.16 C22.2
N$34
  Top 0.203: U2.10 164.66,12.7 | 164.66,12.7 164.66,12.62 | C23.1 163.41,11.01 163.71,11.31 163.71,11.66 163.92,11.88 163.97,11.88 164.58,12.49 164.58,12.61 164.66,12.7
N$35  (via drill 0.35)
  Top 0.203: U3.11 169.51,31.08 169.54,31.11 C27.2
  Top 0.254: R41.2 173.14,33.66 v172.09,33.66 | v170.81,32.38 170.6,32.17 C27.2
  Bottom 0.254: v172.09,33.66 171.45,33.66 170.81,33.02 v170.81,32.38
N$36  (via drill 0.35)
  Top 0.203: U3.2 160.69,31.08 160.02,31.75 v160.02,36.83 158.75,36.83 158.12,36.2 C28.1 | v180.97,36.83 R43.1
  Bottom 0.203: v160.02,36.83 v180.97,36.83
N$37  (via drill 0.35)
  Top 0.203: U2.2 165.06,18.38 165.1,18.41
  Top 0.254: C24.1 174.41,18.62 R33.1 173.99,18 v173.99,17.14 | 165.1,18.41 v165.74,19.05
  Bottom 0.254: v165.74,19.05 172.09,19.05 v173.99,17.14
N$38
  Top 0.203: Q4.2 R38.2 180.56,22.43 R35.1
N$39
  Top 0.203: U2.3 164.66,19.25
  Top 0.254: R34.1 172.5,18.41 C24.2 165.74,20.32 164.66,19.25
N$40
  Top 0.203: R39.2 R37.1 175.96,27.03 Q4.4
N$41
  Top 0.203: C27.1 171.42,31.99 171.42,32.64 171.07,32.99 170.56,32.99 169.05,31.48 U3.12 165.31,31.97 165.31,32.24 165.1,32.45 C26.1
  Top 0.254: R40.2 C27.1
N$42  (via drill 0.35)
  Top 0.203: U3.8 167.79,29.88 v168.05,29.62 | v168.28,22.86 R36.1
  Bottom 0.203: v168.05,29.62 168.05,23.09 v168.28,22.86
N$43  (via drill 0.35)
  Top 0.203: v168.91,29.21 168.5,29.21 168.3,29.01 166.27,29.01 U3.7 | v181.61,24.13 R38.1
  Bottom 0.203: v168.91,29.21 168.91,25.4 170.18,24.13 v181.61,24.13
N$44
  Top 0.203: U3.9 168.25,30.28 168.66,29.87 169.94,29.87 R39.1
N$45  (via drill 0.35)
  Top 0.203: U3.10 168.7,30.68 v168.91,30.47 | v168.91,33.02 168.49,33.44 C25.1
  Bottom 0.203: v168.91,30.47 v168.91,33.02
N$46  (via drill 0.35)
  Top 0.203: U3.3 158.55,30.68 v158.12,31.11 C28.2 | v163.19,36.2 163.83,36.83 R44.1
  Bottom 0.203: v158.12,31.11 v163.19,36.2
N$47
  Top 0.254: R80.1 BAT1_STAT2.C
N$48
  Top 0.254: Q5.4 R53.1 56.3,29.84 R51.2
N$49
  Top 0.254: R81.1 BAT2_STAT1.C
N$50
  Top 0.254: U5.1 68.58,6.99 67.31,5.71 JP1.2
N$51
  Top 0.254: U5.2 69.85,6.99 71.12,5.71 JP2.2
N$52  (via drill 0.35)
  Top 0.254: Q5.2 v55.24,24.77 R54.1 | R52.2 v57.15,22.23
  Bottom 0.254: v57.15,22.23 55.24,24.13 v55.24,24.77
N$53
  Top 0.203: R68.1 2.75,6.49 2,5.74 2,3.95 Q8.1
N$54  (via drill 0.35)
  Top 0.254: U9.4 53.05,16.51 v53.34,16.51 | v59.05,24.77 R54.2
  Bottom 0.254: v59.05,24.77 58.4,25.42 54.63,25.42 52.68,23.47 52.68,18.14 53.34,17.48 v53.34,16.51
N$55  (via drill 0.35)
  Top 0.203: v59.05,27.11 58.2,27.11 R53.2
  Top 0.254: U8.4 52.1,12.41 51.33,13.19 51.33,14.11 51.49,14.27 52.37,14.27 v53.34,15.24
  Bottom 0.203: 52.28,23.7 55.68,27.11 v59.05,27.11
  Bottom 0.254: 52.28,23.7 52.28,17.97 52.68,17.57 52.68,16.24 53.34,15.58 v53.34,15.24
N$56
  Top 0.254: R82.1 BAT2_STAT2.C
N$57
  Top 0.254: D7.C D8.C 47.37,9.84 U11.1
N$58
  Top 0.203: Q9.3 19.34,38.73 18.94,39.14 16.92,39.14 MASTHEAD.P$1
N$59
  Top 0.254: U11.4 51.34,7.18 51.03,7.18 50.73,6.88 50.73,5.68 49.95,4.91 C36.1
N$60  (via drill 0.35)
  Top 0.203: R59.1 R60.2
  Top 0.254: R60.2 44.62,27.55 v44.62,27.94 | v39.44,27.94 38.73,27.94 U12.A0
  Bottom 0.254: v44.62,27.94 v39.44,27.94
N$61  (via drill 0.35)
  Top 0.203: U12.RST v30.48,11.43
  Bottom 0.203: WDT-RST.1 29.44,11.43 v30.48,11.43
N$62  (via drill 0.35)
  Top 0.203: R74.2 R73.1 27.09,23.07 27.94,22.23 v27.94,19.05 | v31.75,18.41 U17.2
  Bottom 0.203: v27.94,19.05 28.57,18.41 v31.75,18.41
N$63
  Top 0.203: R65.1 22.32,34.6 22.32,36.22 23.23,37.12 Q9.1
N$64
  Top 0.203: R66.2 R65.2 22.54,33.12 U14.4
N$65  (via drill 0.35)
  Top 0.203: U13.1 30.48,14.96 v30.48,12.7
  Bottom 0.203: v30.48,12.7 30.25,12.47 WDT-RST.2
N$66
  Top 0.305: Q10.3 28.57,1.91 29.21,1.27 32.38,1.27 33.02,1.91 34.29,3.17 ANEMOMETER.P$1
N$67
  Top 0.203: Q10.1 26.13,3.95 26.13,5.83 R69.1
N$68
  Top 0.203: U12.D14 26.67,13.62 25.78,14.51 25.78,16.6 26.63,17.45 U13.4
N$69  (via drill 0.35)
  Top 0.203: R68.2 R67.2 | U16.4 17.05,15.62 17.05,15.11 17.78,14.38 17.78,5.97 16.7,4.89 16.7,2.1 v16.51,1.91 | v24.08,1.34 24.33,1.59 24.33,3.36 25.18,4.21 R70.2 R69.2 | 1.93,7.6 2.58,8.26 v3.17,8.26 | v11.43,6.99 v11.43,1.91
  Top 0.254: R68.2 1.31,6.99 1.93,7.6 2.14,7.81
  Bottom 0.203: v24.08,1.34 17.07,1.34 v16.51,1.91 v11.43,1.91 | v3.17,8.26 10.16,8.26 v11.43,6.99
N$70
  Top 0.61: TAIL.P$1 37.24,37.87 37.24,37.95 38.63,39.34 40.61,39.34 41.86,38.1 Q11.3
N$71
  Top 0.203: R71.1 43.91,34.6 43.91,36.22 44.81,37.12 Q11.1
N$72
  Top 0.203: R72.2 R71.2 42.23,31.21 U15.4
N$73  (via drill 0.35)
  Top 0.203: R76.2 R75.1 23.71,23.07 22.86,22.23 v22.86,17.14 | U17.6 v37.47,17.14
  Bottom 0.203: v37.47,17.14 v22.86,17.14
N$74
  Top 0.254: R83.2 3V3_PWR.C
N$77
  Top 0.254: R84.2 5V_PWR.C
N$78  (via drill 0.35)
  Top 0.203: R77.1 31.96,17.14 U17.3 34.66,15.88 v34.92,15.88 | v37.47,15.88 U17.5 39.21,15.66 R78.2
  Bottom 0.203: v34.92,15.88 v37.47,15.88
N$81
  Top 0.254: BAT1_PWR.C R85.2
N$82
  Top 0.254: BAT2_PWR.C R86.2
N$83
  Top 0.203: R87.2 PANEL1_PWR.C
N$84
  Top 0.203: R88.2 PANEL2_PWR.C
NEOPIXEL  (via drill 0.35)
  Top 0.203: v12.71,12.06 v12.7,12.06 13.33,12.06 U12.D9 | v1.91,13.97 1.91,23.54 3.2,24.84 3.2,28.1 5.08,29.98 5.08,32.38 6.35,33.66 10.79,33.66 11.43,34.29 MASTHEAD.P$2
  Bottom 0.203: v12.7,12.06 3.81,12.06 v1.91,13.97
PANEL1  (via drill 0.35)
  Top 0.203: R1.2 125.94,17.36 v125.73,17.14 | v121.92,34.29 v125.73,34.29 | R61.2 36.83,26.67 35.56,27.94 v35.56,30.48 | PANEL1_PWR.A 60.33,21.7 v60.33,22.86 | v88.9,35.13 88.9,26.67 87.66,25.43 87.66,24.16 v87.63,24.13
  Top 0.61: PANEL1_POS.TP 128.49,16.51 R1.2
  Top 0.813: D1.A PANEL1_POS.TP
  Bottom 0.203: v125.73,34.29 v125.73,17.14 | v35.56,30.48 41.91,30.48 47.88,36.45 56.41,36.45 58.02,34.85 75.9,34.85 76.44,35.39 88.9,35.39 | v60.33,22.86 61.59,24.13 v87.63,24.13 | v88.9,35.13 88.9,35.39 | v121.92,34.29 120.82,35.39 88.9,35.39
PANEL1_DIV  (via drill 0.35)
  Top 0.203: U12.A1 34.29,27.94 35.34,26.89 R61.1 R62.2 35.34,24.34 v36.2,23.5
  Top 0.254: v100.33,26.67 SYSTEM.P$13
  Bottom 0.203: 36.83,23.5 v36.2,23.5 | 62.41,26.5 61.03,26.5 59.45,28.07 58.66,28.07 58.41,27.82 55.26,27.82 51.9,24.46 51.04,24.46 50.71,24.13 50.16,24.13
  Bottom 0.254: 50.16,24.13 38.27,24.13 37.64,23.5 36.83,23.5 | 62.41,26.5 72.82,26.5 73,26.67 v100.33,26.67
PANEL2  (via drill 0.35)
  Top 0.203: v83.82,27.94 R13.2 | v33.02,28.57 32.6,28.16 R63.2 | PANEL2_PWR.A 61.71,21.07 64.14,23.5 v64.14,27.3
  Top 0.61: R13.2 86.14,17.36 PANEL2_POS.TP
  Top 0.813: D2.A PANEL2_POS.TP
  Bottom 0.203: v83.82,27.94 83.19,28.57 81.92,28.57 81.89,28.55 67.78,28.55 67.33,28.09 64.14,28.09 | v33.02,28.57 33.05,28.55 54.04,28.55 54.41,28.18 58.26,28.18 58.51,28.43 59.6,28.43 59.93,28.09 64.14,28.09 | v64.14,27.3 64.14,28.09
PANEL2_DIV  (via drill 0.35)
  Top 0.203: 31.75,28.16 U12.A2 | R63.1 R64.2 31.54,22.86 31.75,22.86
  Top 0.254: 31.75,28.16 31.75,22.86 v31.75,22.23 | v102.87,25.4 SYSTEM.P$14
  Bottom 0.203: 50.33,23.72 50.8,23.72 51.18,24.1 52.04,24.1 55.4,27.46 58.55,27.46 58.8,27.71 59.31,27.71 59.66,27.36 59.66,27.33 62.36,24.64 62.99,24.64
  Bottom 0.254: v31.75,22.23 31.87,22.34 46.81,22.34 47.3,22.83 48.87,22.83 49.76,23.72 50.33,23.72 | v102.87,25.4 71.49,25.4 70.73,24.64 62.99,24.64
SCL  (via drill 0.35)
  Top 0.203: R50.2 71.75,18.49 72.56,19.3 v72.56,27.13 | v90.17,27.3 SYSTEM.P$9 | U12.D12 v22.86,8.89
  Top 0.254: R50.2 71.12,17.57 U5.12 v71.12,13.34
  Bottom 0.203: v72.56,27.13 89.99,27.13 v90.17,27.3 | v22.86,8.89 27.3,8.89 29.26,6.93
  Bottom 0.254: v71.12,13.34 71.12,2.54 70.48,1.91 58.42,1.91 53.16,7.16 42.43,7.16 39.71,4.45 ANEMOMETER.P$3 39.03,4.45 36.54,6.93 29.26,6.93
SCL1  (via drill 0.35)
  Top 0.203: v160.02,3.17 158.75,3.17 156.66,1.09 80.19,1.09 80.01,1.27 v80.01,1.34 | U2.5 163.87,20.29 v163.83,20.32
  Top 0.254: U5.6 74.93,8.47 v75.67,7.73 R46.2
  Bottom 0.203: v163.83,20.32 163.83,15.88 162.53,14.58 160.4,14.58 160.02,14.19 v160.02,3.17 | v80.01,1.34 75.67,5.68 v75.67,7.73
SCL2  (via drill 0.35)
  Top 0.203: U3.5 158.15,29.88 158.12,29.84 v157.48,29.84 | v80.64,22.86 80.64,17.14 v80.62,17.14 | v109.83,23.5 112.7,20.62 121.03,20.62 121.58,21.16 121.58,21.25 123.83,23.5 v130.81,23.5
  Top 0.254: R49.2 U5.10 73.66,15.24 v72.39,13.97
  Bottom 0.203: v157.48,29.84 137.16,29.84 v130.81,23.5 | v109.83,23.5 81.28,23.5 v80.64,22.86 | v80.62,17.14 79.38,17.14
  Bottom 0.254: v72.39,13.97 75.56,13.97 78.74,17.14 79.38,17.14 80.01,17.14
SDA  (via drill 0.35)
  Top 0.203: R47.2 69.85,18.49 70.65,19.3 70.65,20.5 70.36,20.8 v70.36,29.34 | v87.63,29.84 SYSTEM.P$8
  Top 0.254: R47.2 U5.13 v69.85,13.97 | v19.05,8.26 U12.D11
  Bottom 0.203: v70.36,29.34 87.12,29.34 v87.63,29.84
  Bottom 0.254: v69.85,13.97 70.83,13.97 70.85,13.99 71.39,13.99 71.78,13.61 71.78,2.62 70.65,1.5 58.01,1.5 57.78,1.27 39.37,1.27 ANEMOMETER.P$2 34.75,6.53 20.78,6.53 v19.05,8.26
SDA1  (via drill 0.35)
  Top 0.203: U2.6 163.4,17.14 v162.56,17.14 | v79.38,0.73 157.58,0.73 v159.38,2.54
  Top 0.254: U5.5 73.66,7.83 v74.08,7.41 R45.2
  Bottom 0.203: v74.08,7.41 74.08,3.87 77.47,0.48 79.12,0.48 v79.38,0.73 | v159.38,2.54 159.41,2.57 159.41,3.43 159.66,3.68 159.66,14.34 160.26,14.93 160.35,14.93 v162.56,17.14
SDA2  (via drill 0.35)
  Top 0.203: U3.6 158.22,29.48 v157.72,28.99 | v76.83,22.23 76.83,19.47 R48.2 | v109.83,22.23 110.59,22.23 112.55,20.27 121.18,20.27 123.14,22.23 129.13,22.23 v129.54,22.64
  Top 0.254: U5.9 74.93,17.57 R48.2 75.98,17.78
  Bottom 0.203: v157.72,28.99 138.21,28.99 131.86,22.64 v129.54,22.64 | v109.83,22.23 v76.83,22.23
SENSOR_PWR  (via drill 0.35)
  Top 0.203: U12.D8 11.43,12.14 9.62,13.95 9.62,16.41 v9.53,16.51 | U16.2 17.45,16.86 17.2,16.86 16.92,17.14 v16.51,17.14
  Bottom 0.203: v9.53,16.51 10.16,17.14 v16.51,17.14
SERVO_PWR  (via drill 0.35)
  Top 0.203: U15.2 41.27,18.77 41.44,18.6 41.44,15.05 41.27,14.89 v41.27,10.79 | v25.4,12.06 24.76,11.43 U12.D13
  Bottom 0.203: v25.4,12.06 26.86,12.06 28.1,10.82 41.25,10.82 v41.27,10.79
SIN  (via drill 0.35)
  Top 0.203: v28.57,20.32 28.57,24.34 R74.1 25.37,27.55 25.37,27.56 24.13,28.8 U12.A5 | U17.1 v31.75,19.68
  Bottom 0.203: v31.75,19.68 29.21,19.68 v28.57,20.32
SIN_IN  (via drill 0.35)
  Top 0.203: v22.23,13.34 v22.23,19.68 | v26.67,19.68 R73.2 | v15.24,12.7 14.8,12.26 14.8,10.11 12.7,8.02 ROTATION.P$2
  Bottom 0.203: v22.23,13.34 16.42,13.34 15.78,12.7 v15.24,12.7 | v22.23,19.68 v26.67,19.68
TAIL_SERVO  (via drill 0.35)
  Top 0.203: U12.A4 v26.67,34.29 | v33.02,34.29 TAIL.P$2
  Bottom 0.203: v26.67,34.29 v33.02,34.29
VBAT1  (via drill 0.35, 0.85)
  Top 0.203: U1.9 143.62,10.68 v144.15,10.16 | v147.96,10.16 147.96,6.35 148.59,5.71 | 148.59,5.71 R9.2 | 148.59,5.71 148.81,5.5 C3.2
  Top 0.254: 51.75,25.72 49.58,23.54 49.58,23.08 49.49,22.99 U10.4 46.03,21.27 45.09,20.32 45.09,15.19 D7.A | 51.75,25.72 52.07,26.04 Q5.3 | 51.75,25.72 51.75,27.84 55.24,31.33 R51.1 | Q3.3 172.09,7.68 R29.2 171.88,9.31 R28.2 | R10.2 164.47,4.45 | C10.1 168.28,4.45
  Top 0.813: Q5.3 53.56,26.2 60.41,26.2 61.59,27.38 61.59,35.56 61.9,35.87 61.9,37.28 62.07,37.46 v62.07,37.78 | Q3.3 172.72,5.08 172.09,4.45 168.28,4.45 164.47,4.45 157.61,4.45 C9.1 C8.1 152.16,4.32 R9.2 150.75,2.36 v151.13,1.98 | v121.99,37.47 v124.46,37.47
  Bottom 0.203: v144.15,10.16 v147.96,10.16
  Bottom 0.813: v151.13,1.98 142.99,1.98 142.1,2.88 140.67,2.88 138.58,0.79 128.91,0.79 124.46,5.23 v124.46,37.47 | v62.07,37.78 63.24,38.95 92.59,38.95 94.53,37.01 111.55,37.01 112,37.47 v121.99,37.47
VBAT2  (via drill 0.35, 0.85)
  Top 0.203: Q4.1 176.59,22.23 R35.2 | R36.2 168.28,27.94
  Top 0.254: U10.3 52.11,22.2 Q5.1 | U10.3 50.79,21.27 50.21,20.69 46.09,20.69 45.72,20.32 45.72,15.19 D8.A | U10.3 52.48,20.9 52.82,20.9 53.42,20.3 55.23,20.3 56.05,19.47 R52.1 | R23.2 116.84,4.32 | C20.1 120.65,4.32 | 106.94,4.49 R22.2 104.78,5.71 | U4.9 99.17,10.68 v99.69,10.16 | v104.14,10.16 104.14,6.35 104.78,5.71 | C17.2 104.99,5.5 104.78,5.71
  Top 0.813: Q5.1 53.56,23.66 59.23,23.66 62.87,27.29 62.87,36.88 v63.5,37.52 | Q4.1 173.99,22.86 173.35,23.5 173.35,27.3 172.72,27.94 168.28,27.94 157.48,27.94 156.21,29.21 v156.21,37.79 | v123.19,3.81 122.69,4.32 120.65,4.32 116.84,4.32 C19.1 C18.1 108.34,4.32 R22.2
  Bottom 0.254: v99.69,10.16 v104.14,10.16
  Bottom 0.813: v123.19,3.81 123.19,34.92 | 123.19,34.92 123.19,38.04 124.46,39.31 154.69,39.31 v156.21,37.79 | v63.5,37.52 72.53,37.52 72.99,37.98 92.19,37.98 94.13,36.05 122.07,36.05 123.19,34.92
VREF1  (via drill 0.35)
  Top 0.203: U1.7 U1.6 140.72,6.95 C5.1 140.34,6.99 v138.5,8.82 | R5.2 137.58,9.74 v137.64,9.68
  Bottom 0.203: v137.64,9.68 v138.5,8.82
VREF2
  Top 0.254: U4.7 U4.6 96.27,8.89 | 96.27,8.89 96.27,6.95 C14.1 | R16.2 92.08,9.53 92.71,8.89 96.27,8.89
VSELECT  (via drill 0.35, 0.65, 0.85)
  Top 0.203: Q9.2 23.23,38.99 21.96,37.73 21.96,36.15 R66.1 20.32,34.51 v20.32,27.94 | Q10.2 26.43,2.35 26.43,2.41 26.89,2.86 R70.1 | Q5.8 45.94,23.5 R59.2 44.12,23.28 v43.81,22.98
  Top 0.61: v47.62,8.26 46.63,8.26 44.9,6.53 28.33,6.53 R70.1 | Q5.8 48.2,22.63 v47.62,22.05
  Top 0.813: Q5.8 Q5.7 Q5.6 Q5.5 52.03,31.14 PWR_OUT.P 52.03,38.56 52.59,39.12 v53.34,39.12 112.64,39.12 115.57,36.2 U7.1 U6.1
  Bottom 0.203: v43.81,22.98 36.53,22.98 36.45,22.89 21.56,22.89 20.32,24.13 v20.32,27.94
  Bottom 0.61: v47.62,8.26 v47.62,22.05

## Text on the board
tPlace: BAT2 TEMP | SYSTEM | MASTHEAD | SERVO | BAT1 TEMP | ROTATION | ANEMOMETER
bPlace: - | + | PANEL2+ | PANEL1+ | PANEL2- | PANEL1-